# EAGLE design FormulaCore (EAGLE 9.6.2)
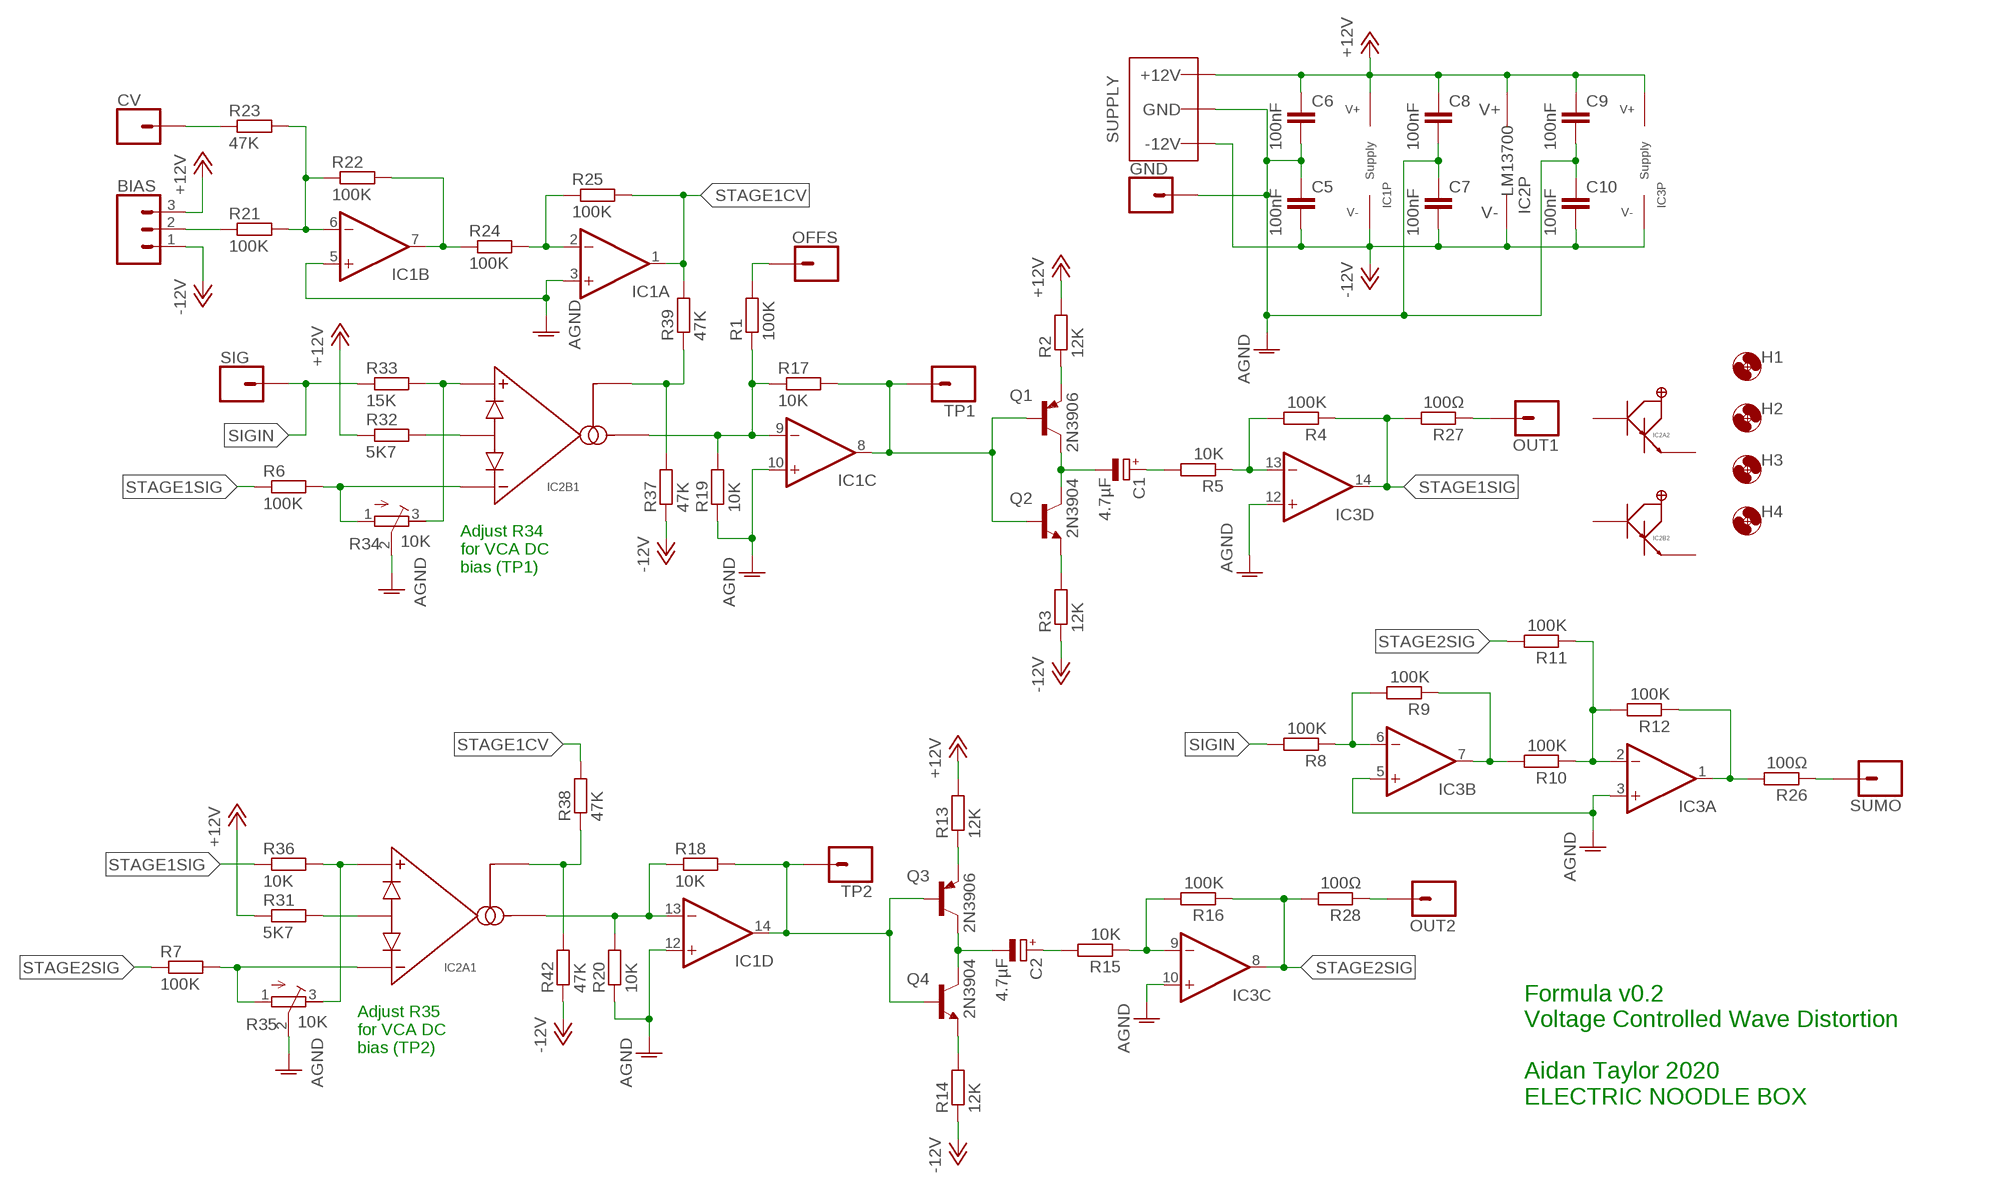
[diagram p0: schematic, sheet 1]

## Parts
BIAS  3XWIREPAD  [1X03]
C1  4.7µF  CPOL-EUE2.5-5  [E2,5-5]
C2  4.7µF  CPOL-EUE2.5-5  [E2,5-5]
C5  100nF  C-EU050-025X075  [C050-025X075]
C6  100nF  C-EU050-025X075  [C050-025X075]
C7  100nF  C-EU050-025X075  [C050-025X075]
C8  100nF  C-EU050-025X075  [C050-025X075]
C9  100nF  C-EU050-025X075  [C050-025X075]
C10  100nF  C-EU050-025X075  [C050-025X075]
CV  1XWIREPAD  [1X01]
GND  1XWIREPAD  [1X01]
H1  MOUNT-HOLE3.2  [3,2]
H2  MOUNT-HOLE3.2  [3,2]
H3  MOUNT-HOLE3.2  [3,2]
H4  MOUNT-HOLE3.2  [3,2]
IC1  TL0X4DIL  [DIL14]
IC2  LM13700DIL  [DIL16]
IC3  TL0X4DIL  [DIL14]
OFFS  1XWIREPAD  [1X01]
OUT1  1XWIREPAD  [1X01]
OUT2  1XWIREPAD  [1X01]
Q1  2N3906  [TO92]
Q2  2N3904  [TO92]
Q3  2N3906  [TO92]
Q4  2N3904  [TO92]
R1  100K  R-EU_0207/7  [0207/7]
R2  12K  R-EU_0207/7  [0207/7]
R3  12K  R-EU_0207/7  [0207/7]
R4  100K  R-EU_0207/7  [0207/7]
R5  10K  R-EU_0207/7  [0207/7]
R6  100K  R-EU_0207/7  [0207/7]
R7  100K  R-EU_0207/7  [0207/7]
R8  100K  R-EU_0207/7  [0207/7]
R9  100K  R-EU_0207/7  [0207/7]
R10  100K  R-EU_0207/7  [0207/7]
R11  100K  R-EU_0207/7  [0207/7]
R12  100K  R-EU_0207/7  [0207/7]
R13  12K  R-EU_0207/7  [0207/7]
R14  12K  R-EU_0207/7  [0207/7]
R15  10K  R-EU_0207/7  [0207/7]
R16  100K  R-EU_0207/7  [0207/7]
R17  10K  R-EU_0207/7  [0207/7]
R18  10K  R-EU_0207/7  [0207/7]
R19  10K  R-EU_0207/7  [0207/7]
R20  10K  R-EU_0207/7  [0207/7]
R21  100K  R-EU_0207/7  [0207/7]
R22  100K  R-EU_0207/7  [0207/7]
R23  47K  R-EU_0207/7  [0207/7]
R24  100K  R-EU_0207/7  [0207/7]
R25  100K  R-EU_0207/7  [0207/7]
R26  100Ω  R-EU_0207/7  [0207/7]
R27  100Ω  R-EU_0207/7  [0207/7]
R28  100Ω  R-EU_0207/7  [0207/7]
R31  5K7  R-EU_0207/7  [0207/7]
R32  5K7  R-EU_0207/7  [0207/7]
R33  15K  R-EU_0207/7  [0207/7]
R34  10K  R-TRIMM3296W  [RTRIM3296W]
R35  10K  R-TRIMM3296W  [RTRIM3296W]
R36  10K  R-EU_0207/7  [0207/7]
R37  47K  R-EU_0207/7  [0207/7]
R38  47K  R-EU_0207/7  [0207/7]
R39  47K  R-EU_0207/7  [0207/7]
R42  47K  R-EU_0207/7  [0207/7]
SIG  1XWIREPAD  [1X01]
SUMO  1XWIREPAD  [1X01]
TP1  1XWIREPAD  [1X01]
TP2  1XWIREPAD  [1X01]
WP1  COMBO_SUPPLY_HEADER  [COMBINED_POWER]

## Nets
+12V: BIAS.3 C6.1 C8.1 C9.1 IC1.4(P:V+) IC2.11(P:V+) IC3.4(P:V+) R2.2 R13.2 R31.1 R32.1 WP1.V+1(V++) WP1.V+2(V++) WP1.V+3(V++)
-12V: BIAS.1 C5.2 C7.2 C10.2 IC1.11(P:V-) IC2.6(P:V-) IC3.11(P:V-) R3.1 R14.1 R37.1 R42.1 WP1.V-1(V--) WP1.V-2(V--) WP1.V-3(V--)
AGND: C5.1 C6.2 C7.1 C8.2 C9.2 C10.1 GND.1 IC1.3(A:+IN) IC1.5(B:+IN) IC1.10(C:+IN) IC1.12(D:+IN) IC3.3(A:+IN) IC3.5(B:+IN) IC3.10(C:+IN) IC3.12(D:+IN) R19.1 R20.1 R34.2(S) R35.2(S) WP1.GND1(AGND) WP1.GND2(AGND) WP1.GND3(AGND) WP1.GND4(AGND) WP1.GND5(AGND) WP1.GND6(AGND) WP1.GND7(AGND) WP1.GND8(AGND)
N$1: C1.+ R5.2
N$2: Q1.3(E) R2.1
N$3: Q2.3(E) R3.2
N$4: C1.- Q1.1(C) Q2.1(C)
N$5: IC3.13(D:-IN) R4.2 R5.1
N$6: C2.+ R15.2
N$7: IC3.6(B:-IN) R8.1 R9.2
N$8: IC3.1(A:OUT) R12.1 R26.2
N$9: IC1.8(C:OUT) Q1.2(B) Q2.2(B) R17.2 TP1.1
N$10: Q3.3(E) R13.1
N$11: C2.- Q3.1(C) Q4.1(C)
N$12: OFFS.1 R1.2
N$13: R26.1 SUMO.1
N$14: IC3.7(B:OUT) R9.1 R10.2
N$15: OUT1.1 R27.1
N$16: IC3.2(A:-IN) R10.1 R11.1 R12.2
N$17: Q4.3(E) R14.2
N$18: OUT2.1 R28.1
N$19: IC3.9(C:-IN) R15.1 R16.2
N$21: IC1.13(D:-IN) IC2.5(A1:AMPOUT) R18.1 R20.2
N$22: IC1.9(C:-IN) IC2.12(B1:AMPOUT) R1.1 R17.1 R19.2
N$23: IC1.14(D:OUT) Q3.2(B) Q4.2(B) R18.2 TP2.1
N$24: IC1.6(B:-IN) R21.2 R22.1 R23.2
N$25: IC1.7(B:OUT) R22.2 R24.1
N$26: IC1.2(A:-IN) R24.2 R25.1
N$30: BIAS.2 R21.1
N$32: CV.1 R23.1
N$35: IC2.3(A1:AMP+) R35.3(E) R36.2
N$36: IC2.4(A1:AMP-) R7.2 R35.1(A)
N$37: IC2.2(A1:DIODES) R31.2
N$38: IC2.15(B1:DIODES) R32.2
N$39: IC2.16(B1:AMPBIAS) R37.2 R39.1
N$41: IC2.14(B1:AMP+) R33.2 R34.3(E)
N$42: IC2.13(B1:AMP-) R6.2 R34.1(A)
N$43: IC2.1(A1:AMPBIAS) R38.1 R42.2
SIGIN: R8.2 R33.1 SIG.1
STAGE1CV: IC1.1(A:OUT) R25.2 R38.2 R39.2
STAGE1SIG: IC3.14(D:OUT) R4.1 R6.1 R27.2 R36.1
STAGE2SIG: IC3.8(C:OUT) R7.1 R11.2 R16.1 R28.2
Unconnected: IC2.7(A2:BUFF_IN) IC2.8(A2:BUFF_OUT) IC2.9(B2:BUFF_OUT) IC2.10(B2:BUFF_IN)

## Notes on the sheet
- Adjust R34
  for VCA DC
  bias (TP1)
- Adjust R35
  for VCA DC
  bias (TP2)
- Formula v0.2
  Voltage Controlled Wave Distortion
  
  Aidan Taylor 2020 
  ELECTRIC NOODLE BOX

## Library data of the parts
BIAS = ElectricNoodleBox:3XWIREPAD
C1 C2 = rcl:CPOL-EU: POLARIZED CAPACITOR, European symbol; SPICEPREFIX: C
C5-C10 = rcl:C-EU: CAPACITOR, European symbol; SPICEPREFIX: C
CV GND OFFS OUT1 OUT2 SIG SUMO TP1 TP2 = ElectricNoodleBox:1XWIREPAD
H1-H4 = holes:MOUNT-HOLE: MOUNTING HOLE with drill center marker
IC1 IC3 = ElectricNoodleBox:TL0X4: Quad Operational Amplifier; CATALOGUE: 3005140; RETAILER: Farnell
IC2 = ElectricNoodleBox:LM13700: Dual Transconductance Amplifier with Darlington Buffer; CATALOGUE: 3118206; RETAILER: Farnell
Q1 Q3 = transistor-pnp:2N3906: PNP Transistor
Q2 Q4 = transistor-npn:2N3904: NPN Transistor
R1-R28 R31-R33 R36-R39 R42 = rcl:R-EU_: RESISTOR, European symbol; SPICEPREFIX: R
R34 R35 = rcl:R-TRIMM: Trimm resistor; SPICEMODEL: X; SPICEPREFIXL: POT
WP1 = ElectricNoodleBox:COMBO_SUPPLY_HEADER

## Board
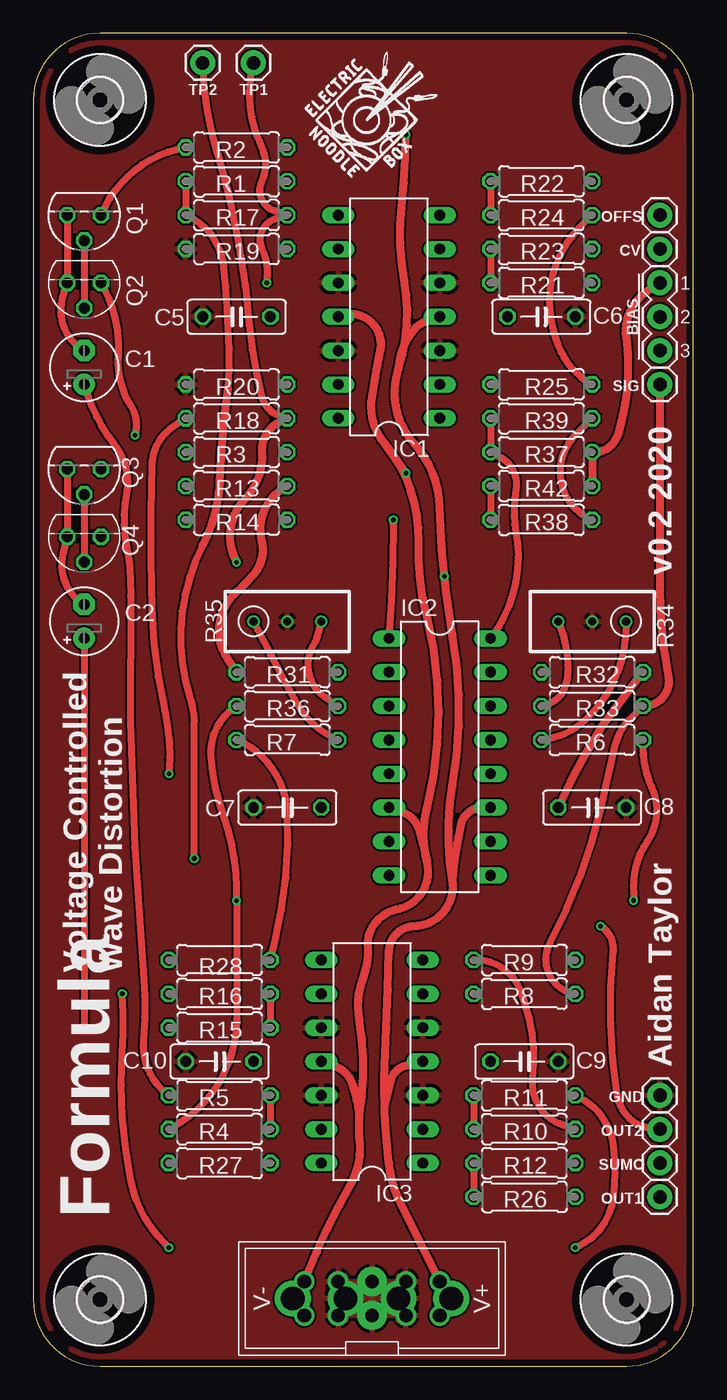
[diagram p1: board, top side]
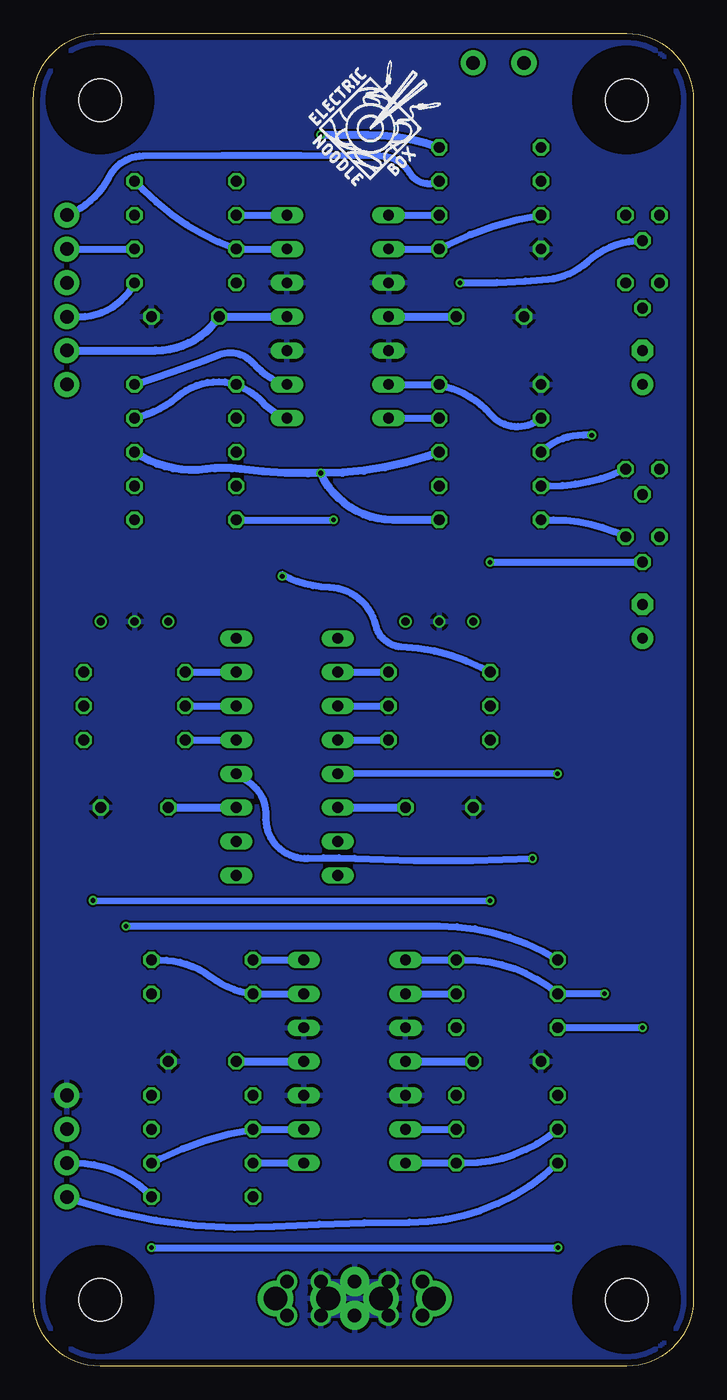
[diagram p2: board, bottom side, seen from below]

Size 49.5 x 100 mm. Coordinates in mm from the lower left corner, seen from the top.
Outline: 0,95 0,5 arc90 5,0 44.5,0 arc90 49.5,5 49.5,95 arc90 44.5,100 5,100 arc90 0,95
Copper layers (1*16): Top 0.035mm / dielectric 1.6mm / Bottom 0.035mm
Design rules "Elecrow_2-layer_PCB_eagle_rule": minimum track width 6mil, minimum drill 12mil, track to track 6mil, track to pad 6mil, pad to pad 6mil, via to via 8mil, smd to smd 0mil, copper to edge 20mil, drill to drill 10mil, minimum pad ring 6mil, minimum via ring 6mil, stop-mask expansion 0mil, vias tented up to drill 100mil, thermal gap 10mil

### Footprints (pad centres in the part's own frame; a part is rotated, then mirrored left to right if it is on the bottom)
1X03 = drill 1.016 pad 1.88: 1 0,0; 2 2.54,0; 3 5.08,0
E2,5-5 = drill 0.813 pad 1.6: + -1.27,0 | drill 0.813 pad 1.6 octagon: - 1.27,0
C050-025X075 = drill 0.813 octagon: 1 -2.54,0; 2 2.54,0
1X01 = drill 1.016 pad 1.88: 1 0,0
3,2 = hole 3.2: 0,0
DIL14 = drill 0.813 long: 1 -7.62,-3.81; 2 -5.08,-3.81; 3 -2.54,-3.81; 4 0,-3.81; 5 2.54,-3.81; 6 5.08,-3.81; 7 7.62,-3.81; 8 7.62,3.81; 9 5.08,3.81; 10 2.54,3.81; 11 0,3.81; 12 -2.54,3.81; 13 -5.08,3.81; 14 -7.62,3.81
DIL16 = drill 0.813 long: 1 -8.89,-3.81; 2 -6.35,-3.81; 3 -3.81,-3.81; 4 -1.27,-3.81; 5 1.27,-3.81; 6 3.81,-3.81; 7 6.35,-3.81; 8 8.89,-3.81; 9 8.89,3.81; 10 6.35,3.81; 11 3.81,3.81; 12 1.27,3.81; 13 -1.27,3.81; 14 -3.81,3.81; 15 -6.35,3.81; 16 -8.89,3.81
TO92 = drill 0.813 octagon: 1 1.27,0; 2 0,1.905; 3 -1.27,0
0207/7 = drill 0.813 octagon: 1 -3.81,0; 2 3.81,0
RTRIM3296W = drill 0.61: 1 0,-2.54; 2 0,0; 3 0,2.54
COMBINED_POWER = drill 1.78: GND1 -1.98,0; GND2 1.98,0; V+1 -5.94,0; V-1 5.94,0 | drill 1.016: GND3 -2.54,1.27; GND5 2.54,1.27; GND6 -2.54,-1.27; GND8 2.54,-1.27; V+2 -5.08,1.27; V+3 -5.08,-1.27; V-2 5.08,1.27; V-3 5.08,-1.27 | drill 1.016 pad 2.184: GND4 0,1.27; GND7 0,-1.27

### Placement (x,y rotation side)
BIAS  46.99,81.28 270 top
C1  3.81,74.93 90 top
C2  3.81,55.88 90 top
C5  15.24,78.74 0 top
C6  38.1,78.74 0 top
C7  19.05,41.91 0 top
C8  41.91,41.91 0 top
C9  36.83,22.86 0 top
C10  13.97,22.86 0 top
CV  46.99,83.82 0 top
GND  46.99,20.32 0 top
H1  44.5,95 0 top
H2  5,95 0 top
H3  5,5 0 top
H4  44.5,5 0 top
IC1  26.67,78.74 90 top
IC2  30.48,45.72 270 top
IC3  25.4,22.86 90 top
OFFS  46.99,86.36 0 top
OUT1  46.99,12.7 0 top
OUT2  46.99,17.78 0 top
Q1  3.81,86.36 180 top
Q2  3.81,81.28 180 top
Q3  3.81,67.31 180 top
Q4  3.81,62.23 180 top
R1  15.24,88.9 0 top
R2  15.24,91.44 0 top
R3  15.24,68.58 180 top
R4  13.97,17.78 0 top
R5  13.97,20.32 180 top
R6  41.91,46.99 180 top
R7  19.05,46.99 0 top
R8  36.83,27.94 0 top
R9  36.83,30.48 0 top
R10  36.83,17.78 0 top
R11  36.83,20.32 0 top
R12  36.83,15.24 0 top
R13  15.24,66.04 0 top
R14  15.24,63.5 180 top
R15  13.97,25.4 180 top
R16  13.97,27.94 0 top
R17  15.24,86.36 0 top
R18  15.24,71.12 0 top
R19  15.24,83.82 0 top
R20  15.24,73.66 0 top
R21  38.1,81.28 180 top
R22  38.1,88.9 180 top
R23  38.1,83.82 180 top
R24  38.1,86.36 0 top
R25  38.1,73.66 180 top
R26  36.83,12.7 180 top
R27  13.97,15.24 0 top
R28  13.97,30.48 0 top
R31  19.05,52.07 0 top
R32  41.91,52.07 180 top
R33  41.91,49.53 180 top
R34  41.91,55.88 90 top
R35  19.05,55.88 270 top
R36  19.05,49.53 0 top
R37  38.1,68.58 180 top
R38  38.1,63.5 0 top
R39  38.1,71.12 0 top
R42  38.1,66.04 180 top
SIG  46.99,73.66 0 top
SUMO  46.99,15.24 0 top
TP1  16.51,97.79 90 top
TP2  12.7,97.79 90 top
U$1  [LOGO10X10]  20.32,88.9 0 top
U$2  [LOGO10X10]  28.89,88.27 0 bottom
WP1  25.4,5.08 180 top

### Tracks (layer width: path | path; a pad name or v marks a point on that pad's centre or on a via)
+12V  (via drill 0.35)
  Top 0.508: v30.83,59.27 30.48,64.45
  Top 0.61: R32.1 42.5,47.77 arc9 C8.1 | WP1.V+2 WP1.V+1 WP1.V+3 27.62,12.06 arc-20 26.67,15.24 arc-4 26.35,19.05 26.35,19.68 | 26.35,19.68 arc-5 26.35,22.54 arc1 26.67,31.11 arc-87 28.57,33.02 arc98 31.43,36.51 | 31.43,36.51 arc-20 31.43,43.5 arc20 31.43,54.93 arc-8 30.48,64.45 arc41 28.57,69.22 arc-60 27.38,74.79 | 27.38,74.79 arc28 27.83,81.48 arc-16 27.62,87 arc5 v27.94,92.39 | IC2.11 33.66,41.91 arc77 32.07,40.64 arc8 31.43,36.51 | IC3.4 27.94,22.54 arc62 26.78,21.38 26.35,19.68 | IC1.4 29.53,78.42 arc31 28.57,77.79 arc39 27.38,74.79 | R31.1 14.61,53.02 arc-82 15.24,58.1 arc6 16.51,59.37 arc56 17.14,61.91 arc-78 R13.2
  Bottom 0.508: R31.1 15.88,52.39 arc-24 21.91,53.98 arc74 23.81,55.56 arc-75 27.3,58.42 arc27 30.8,59.37 arc-207 v30.83,59.27
  Bottom 0.61: BIAS.3 40.32,76.2 arc-56 C6.1 IC1.4 | C8.1 IC2.11 | C9.1 IC3.4 | R2.2 arc-20 24.45,92.39 v27.94,92.39
-12V  (via drill 0.35)
  Top 0.61: BIAS.1 46.04,80.64 arc64 44.45,77.15 arc-25 43.81,69.85 arc-78 R37.1 R42.1 | WP1.V-2 WP1.V-1 WP1.V-3 21.27,8.57 arc-7 23.81,13.65 arc39 24.45,17.14 24.45,18.73 | 24.45,18.73 arc19 24.45,26.04 arc-30 24.77,29.21 arc27 25.08,31.75 arc-76 27.3,34.29 arc93 29.53,37.78 | 29.53,37.78 arc-28 29.53,41.91 arc28 29.53,56.2 arc-15 28.89,61.91 arc41 26.35,69.22 | 26.35,69.22 arc-49 25.4,72.71 arc-2 26.04,76.2 arc125 IC1.11 | IC2.6 27.62,41.59 arc-53 28.89,40.32 arc-9 29.53,37.78 | IC3.11 22.54,22.54 arc-53 23.93,21.16 arc-13 24.45,18.73 | v27.94,67 26.35,69.22
  Bottom 0.61: IC1.11 C5.2 | IC2.6 C7.2 | R3.1 20,68.26 arc19 v27.94,66.99 | v27.94,66.99 arc161 v27.94,67 28.89,66.99 arc9 33.97,67.31 arc-16 36.51,67.31 arc42 R37.1 | R14.1 22.54,63.5 arc66 v27.94,66.99 | IC3.11 C10.2
AGND
  pour Top: 0,0 49.53,0 49.53,100.33 0,100.33
  pour Bottom: 0,0 49.53,0 49.53,100.33 0,100.33
N$1
  Top 0.508: C1.+ 4.13,72.71 arc20 6.03,69.22 arc-49 6.99,65.41 arc21 6.99,61.59 arc-12 7.3,57.78 arc6 8.26,29.53 arc-10 8.26,24.45 arc60 R5.2
N$2
  Top 0.508: Q1.3 5.4,87 arc-54 R2.1
N$3  (via drill 0.35)
  Top 0.508: Q2.3 5.4,80.64 arc-31 6.35,75.88 arc36 7.3,72.07 arc-48 v7.62,69.85
  Bottom 0.508: v7.62,69.85 8.26,69.85 arc-44 R3.2
N$4
  Top 0.508: Q1.1 Q2.1 2.22,80.33 arc79 C1.-
N$5
  Top 0.508: R5.1 R4.2
  Bottom 0.508: IC3.13 R4.2
N$6  (via drill 0.35)
  Top 0.508: C2.+ v3.81,25.4
  Bottom 0.508: v3.81,25.4 R15.2
N$7
  Bottom 0.508: R9.2 40.01,30.48 arc37 36.2,29.21 arc-30 R8.1 IC3.6
N$8
  Top 0.508: R12.1 R26.2
  Bottom 0.508: R12.1 IC3.1
N$9  (via drill 0.35)
  Top 0.508: TP1.1 arc39 17.14,91.44 arc-50 17.14,88.9 arc97 18.1,86.68 R17.2 18.1,86.04 arc97 17.14,83.82 arc-36 17.46,81.28 arc216 v17.5,81.28 | Q1.2 Q2.2
  Bottom 0.508: IC1.8 R17.2 | Q1.2 arc-43 7.94,82.87 arc31 10.48,81.6 arc7 16.83,81.28 v17.5,81.28
N$10
  Bottom 0.508: R13.1 10.79,66.04 arc-25 Q3.3
N$11
  Top 0.508: Q3.1 Q4.1 2.22,60.96 arc73 C2.-
N$12
  Bottom 0.508: OFFS.1 46.35,86.68 arc-37 43.81,89.22 arc63 41.27,90.81 arc1 23.5,90.81 arc58 21.27,89.53 arc-86 R1.2
N$13
  Bottom 0.508: SUMO.1 46.35,15.24 arc48 R26.1
N$14
  Top 0.508: R10.2 39.69,18.1 arc-78 37.47,21.59 arc30 36.51,28.26 arc69 R9.1
  Bottom 0.508: R9.1 IC3.7
N$15
  Bottom 0.508: OUT1.1 46.04,12.38 arc-22 31.43,10.48 arc4 21.27,10.79 arc-44 R27.1
N$16
  Top 0.508: R11.1 R10.1
  Bottom 0.508: R12.2 40.01,15.56 arc18 R10.1 IC3.2
N$17
  Bottom 0.508: R14.2 10.48,63.5 arc26 Q4.3
N$18  (via drill 0.35)
  Top 0.508: OUT2.1 46.78,17.78 arc-81 43.8,20.34 arc-14 43.5,31.11 arc64 v42.55,33.02
  Bottom 0.508: v42.55,33.02 19.05,33.02 arc32 R28.1
N$19
  Top 0.508: R16.2 R15.1
  Bottom 0.508: IC3.9 R16.2
N$21  (via drill 0.35)
  Top 0.508: R18.1 10.48,70.48 arc55 8.89,67.63 arc4 8.89,56.83 arc11 9.84,49.21 arc-17 10.16,44.45 arc197 v10.18,44.45
  Bottom 0.508: IC1.13 R20.2 18.1,73.34 arc31 15.24,71.44 arc-88 R18.1 | v10.18,44.45 IC2.5
N$22  (via drill 0.35)
  Top 0.508: v12.06,38.1 12.06,48.31 arc16 11.75,50.16 arc-45 12.7,61.59 | R1.1 R17.1 arc-60 14.29,82.55 arc-6 14.61,77.79 arc-11 14.61,73.34
  Top 0.61: 12.7,61.59 arc24 13.97,66.36 arc-5 14.61,73.34
  Bottom 0.508: IC2.12 33.34,43.81 arc59 32.07,41.27 arc-96 28.89,38.1 arc6 25.4,38.1 arc-6 v12.06,38.1 | IC1.9 R19.2 18.41,84.14 arc18 R17.1
N$23  (via drill 0.35)
  Top 0.508: TP2.1 arc15 13.81,90.91 arc-10 15.88,81.03 arc-1 16.19,78.11 arc9 17.14,72.71 arc68 18.82,71.24 R18.2 | Q3.2 Q4.2
  Top 0.61: R18.2 18.41,70.8 arc67 17.14,68.58 arc-48 15.88,65.09 arc73 v15.24,60.33
  Bottom 0.508: IC1.14 R18.2 | v15.24,60.33 Q4.2
N$24
  Top 0.508: R23.2 R21.2
  Bottom 0.508: R22.1 41.27,88.27 arc-25 R23.2 IC1.6
N$25
  Top 0.508: R22.2 R24.1
  Bottom 0.508: R24.1 IC1.7
N$26
  Top 0.508: R24.2 40.96,85.41 arc40 38.73,80.64 arc28 39.37,76.52 arc38 R25.1
  Bottom 0.508: R25.1 39.05,74.61 arc-3 35.56,75.88 arc71 33.02,75.25 arc-35 IC1.2
N$30
  Bottom 0.508: BIAS.2 46.04,78.74 arc-63 R21.1
N$32
  Bottom 0.508: CV.1 R23.1
N$35
  Top 0.508: R36.2 21.91,50.16 arc-85 20.95,53.98 arc20 R35.3
  Bottom 0.508: IC2.3 R36.2
N$36
  Top 0.508: R35.1 16.83,55.24 arc3 19.68,49.85 arc38 R7.2
  Bottom 0.508: IC2.4 R7.2
N$37
  Bottom 0.508: IC2.2 R31.2
N$38
  Bottom 0.508: R32.2 IC2.15
N$39
  Top 0.508: R39.1 R37.2 34.92,68.26 arc-74 36.2,65.72 arc21 36.2,62.55 arc-48 IC2.16
N$41
  Top 0.508: R34.3 39.69,54.93 arc-26 40.01,51.44 arc-74 R33.2
  Bottom 0.508: R33.2 IC2.14
N$42
  Top 0.508: R34.1 44.45,55.56 arc-46 41.42,48.5 arc-38 R6.2
  Bottom 0.508: R6.2 IC2.13
N$43  (via drill 0.35)
  Top 0.508: R42.2 R38.1 | v26.99,63.5 26.99,63.18 arc-4 IC2.1
  Bottom 0.508: R38.1 v26.99,63.5
SIGIN
  Top 0.508: R33.1 44.69,48.5 arc32 43.62,46.58 42.55,41.91 arc-15 38.73,31.75 arc109 R8.2
  Top 0.61: SIG.1 46.99,58.1 arc11 47.62,51.75 arc-104 R33.1
STAGE1CV
  Top 0.508: R39.2 40.64,69.85 arc113 R38.2
  Bottom 0.508: R39.2 40.96,71.44 arc-23 38.73,72.71 arc58 R25.2 33.66,73.34 arc21 32.38,72.39 arc-27 IC1.1
STAGE1SIG  (via drill 0.35)
  Top 0.508: R6.1 45.72,46.35 arc25 46.35,43.5 arc-59 46.04,39.37 arc44 45.09,34.92 arc-224 v45.02,34.94 | R4.1 arc63 15.24,26.04 v15.24,34.92 15.24,35.88 arc20 14.29,41.27 arc-16 13.34,45.72 arc-61 R36.1
  Bottom 0.508: v45.02,34.94 v15.24,34.92 | IC3.14 R27.2 17.14,15.24 arc-40 R4.1
STAGE2SIG  (via drill 0.35)
  Top 0.508: R11.2 40.93,20.17 arc-57 43.5,16.51 arc-13 43.5,12.7 arc-61 v40.64,8.89 | v10.16,8.89 9.84,9.21 arc-34 7.3,13.97 arc-15 6.67,23.5 arc7 v6.67,27.94 | R28.2 18.1,31.75 arc17 19.05,41.59 arc64 R7.1
  Bottom 0.508: v40.64,8.89 v10.16,8.89 | IC3.8 R28.2 17.14,30.48 arc40 R16.1 v6.67,27.94

### Text on the board
tPlace: 1 | 2 | 3 | v0.2 2020 | Aidan Taylor | Voltage Controlled / Wave Distortion | Formula